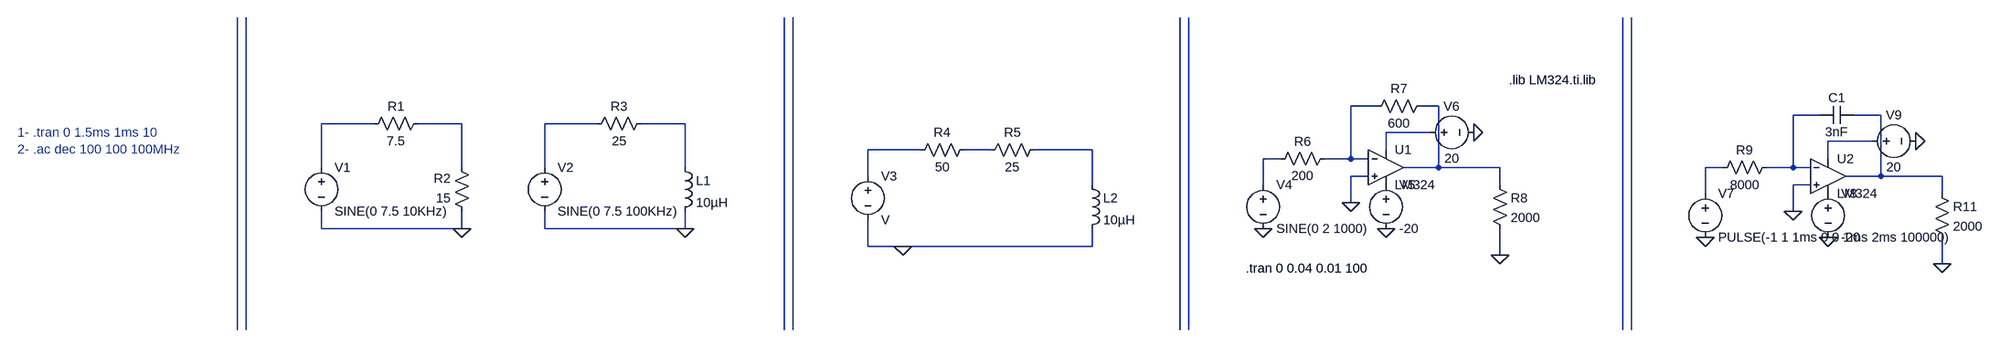
[diagram p0: schematic Circuit Theory Lab-1.asc]
Circuit Theory Lab-1.asc, the LTspice schematic file:
Version 4
SHEET 1 3272 680
WIRE 2000 48 1952 48
WIRE 2112 48 2080 48
WIRE 2848 64 2800 64
WIRE 2960 64 2912 64
WIRE -16 80 -112 80
WIRE 144 80 64 80
WIRE 416 80 320 80
WIRE 576 80 496 80
WIRE 2096 96 2016 96
WIRE 2944 112 2864 112
WIRE 1072 128 976 128
WIRE 1200 128 1152 128
WIRE 1392 128 1280 128
WIRE 2016 128 2016 96
WIRE 1824 144 1792 144
WIRE 1952 144 1952 48
WIRE 1952 144 1904 144
WIRE 1984 144 1952 144
WIRE 2864 144 2864 112
WIRE -112 160 -112 80
WIRE 144 160 144 80
WIRE 320 160 320 80
WIRE 576 160 576 80
WIRE 2112 160 2112 48
WIRE 2112 160 2048 160
WIRE 2224 160 2112 160
WIRE 2672 160 2640 160
WIRE 2800 160 2800 64
WIRE 2800 160 2752 160
WIRE 2832 160 2800 160
WIRE 976 176 976 128
WIRE 1984 176 1952 176
WIRE 2960 176 2960 64
WIRE 2960 176 2896 176
WIRE 3072 176 2960 176
WIRE 1392 192 1392 128
WIRE 1792 192 1792 144
WIRE 2224 192 2224 160
WIRE 2832 192 2800 192
WIRE 2640 208 2640 160
WIRE 3072 208 3072 176
WIRE 1952 224 1952 176
WIRE 2800 240 2800 192
WIRE -112 272 -112 240
WIRE 144 272 144 240
WIRE 144 272 -112 272
WIRE 320 272 320 240
WIRE 576 272 576 240
WIRE 576 272 320 272
WIRE 976 304 976 256
WIRE 1040 304 976 304
WIRE 1392 304 1392 272
WIRE 1392 304 1040 304
WIRE 2224 320 2224 272
WIRE 3072 336 3072 288
WIRE -304 480 -304 -144
WIRE -288 480 -288 -144
WIRE 800 480 800 -144
WIRE 816 480 816 -144
WIRE 1552 480 1552 -144
WIRE 1568 480 1568 -144
WIRE 2448 480 2448 -144
WIRE 2464 480 2464 -144
FLAG 144 272 0
FLAG 576 272 0
FLAG 1040 304 0
FLAG 1792 272 0
FLAG 2224 320 0
FLAG 1952 224 0
FLAG 2016 272 0
FLAG 2176 96 0
FLAG 2640 288 0
FLAG 3072 336 0
FLAG 2800 240 0
FLAG 2864 288 0
FLAG 3024 112 0
SYMBOL res 80 64 R90
WINDOW 0 0 56 VBottom 2
WINDOW 3 32 56 VTop 2
SYMATTR InstName R1
SYMATTR Value 7.5
SYMBOL res 160 256 R180
WINDOW 0 36 76 Left 2
WINDOW 3 36 40 Left 2
SYMATTR InstName R2
SYMATTR Value 15
SYMBOL voltage -112 144 R0
WINDOW 123 0 0 Left 0
WINDOW 39 0 0 Left 0
SYMATTR InstName V1
SYMATTR Value SINE(0 7.5 10KHz)
SYMBOL res 512 64 R90
WINDOW 0 0 56 VBottom 2
WINDOW 3 32 56 VTop 2
SYMATTR InstName R3
SYMATTR Value 25
SYMBOL voltage 320 144 R0
WINDOW 123 0 0 Left 0
WINDOW 39 0 0 Left 0
SYMATTR InstName V2
SYMATTR Value SINE(0 7.5 100KHz)
SYMBOL ind 560 144 R0
SYMATTR InstName L1
SYMATTR Value 10µH
SYMBOL voltage 976 160 R0
SYMATTR InstName V3
SYMBOL res 1056 144 R270
WINDOW 0 32 56 VTop 2
WINDOW 3 0 56 VBottom 2
SYMATTR InstName R4
SYMATTR Value 50
SYMBOL res 1296 112 R90
WINDOW 0 0 56 VBottom 2
WINDOW 3 32 56 VTop 2
SYMATTR InstName R5
SYMATTR Value 25
SYMBOL ind 1376 176 R0
SYMATTR InstName L2
SYMATTR Value 10µH
SYMBOL OpAmps\\opamp2 2016 96 R0
SYMATTR InstName U1
SYMATTR Value LM324
SYMBOL voltage 1792 176 R0
WINDOW 123 0 0 Left 0
WINDOW 39 0 0 Left 0
SYMATTR InstName V4
SYMATTR Value SINE(0 2 1000)
SYMBOL res 1920 128 R90
WINDOW 0 0 56 VBottom 2
WINDOW 3 32 56 VTop 2
SYMATTR InstName R6
SYMATTR Value 200
SYMBOL res 2096 32 R90
WINDOW 0 0 56 VBottom 2
WINDOW 3 32 56 VTop 2
SYMATTR InstName R7
SYMATTR Value 600
SYMBOL res 2208 176 R0
SYMATTR InstName R8
SYMATTR Value 2000
SYMBOL voltage 2016 176 R0
WINDOW 123 0 0 Left 0
WINDOW 39 0 0 Left 0
SYMATTR InstName V5
SYMATTR Value -20
SYMBOL voltage 2080 96 R270
WINDOW 0 32 56 VTop 2
WINDOW 3 -32 56 VBottom 2
WINDOW 123 0 0 Left 0
WINDOW 39 0 0 Left 0
SYMATTR InstName V6
SYMATTR Value 20
SYMBOL OpAmps\\opamp2 2864 112 R0
SYMATTR InstName U2
SYMATTR Value LM324
SYMBOL voltage 2640 192 R0
WINDOW 123 0 0 Left 0
WINDOW 39 0 0 Left 0
SYMATTR InstName V7
SYMATTR Value PULSE(-1 1 1ms 0 0 1ms 2ms 100000)
SYMBOL res 3056 192 R0
SYMATTR InstName R11
SYMATTR Value 2000
SYMBOL voltage 2864 192 R0
WINDOW 123 0 0 Left 0
WINDOW 39 0 0 Left 0
SYMATTR InstName V8
SYMATTR Value -20
SYMBOL voltage 2928 112 R270
WINDOW 0 32 56 VTop 2
WINDOW 3 -32 56 VBottom 2
WINDOW 123 0 0 Left 0
WINDOW 39 0 0 Left 0
SYMATTR InstName V9
SYMATTR Value 20
SYMBOL cap 2912 48 R90
WINDOW 0 0 32 VBottom 2
WINDOW 3 32 32 VTop 2
SYMATTR InstName C1
SYMATTR Value 3nF
SYMBOL res 2768 144 R90
WINDOW 0 0 56 VBottom 2
WINDOW 3 32 56 VTop 2
SYMATTR InstName R9
SYMATTR Value 8000
TEXT -728 96 Left 2 ;1- .tran 0 1.5ms 1ms 10\n2- .ac dec 100 100 100MHz
TEXT 2240 0 Left 2 !.lib LM324.ti.lib
TEXT 1760 344 Left 2 !.tran 0 0.04 0.01 100

The netlist it stands for:
* Circuit Theory Lab-1.asc
R1 N006 N005 7.5
R2 0 N006 15
V1 N005 0 SINE(0 7.5 10KHz)
R3 N008 N007 25
V2 N007 0 SINE(0 7.5 100KHz)
L1 N008 0 10µH
V3 N011 0 V
R4 N011 N012 50
R5 N013 N012 25
L2 N013 0 10µH
XU1 0 N001 N009 P001 N002 LM324  ; pins In+ In- V+ V- OUT
V4 N014 0 SINE(0 2 1000)
R6 N001 N014 200
R7 N002 N001 600
R8 N002 0 2000
V5 P001 0 -20
V6 N009 0 20
XU2 0 N003 N010 P002 N004 LM324  ; pins In+ In- V+ V- OUT
V7 N015 0 PULSE(-1 1 1ms 0 0 1ms 2ms 100000)
R11 N004 0 2000
V8 P002 0 -20
V9 N010 0 20
C1 N004 N003 3nF
R9 N003 N015 8000
* 1- .tran 0 1.5ms 1ms 10
* 2- .ac dec 100 100 100MHz
.lib LM324.ti.lib
.tran 0 0.04 0.01 100
.backanno
.end